# EAGLE design pc_healthypi_move_nRF5340_v1 (EAGLE 9.6.2)
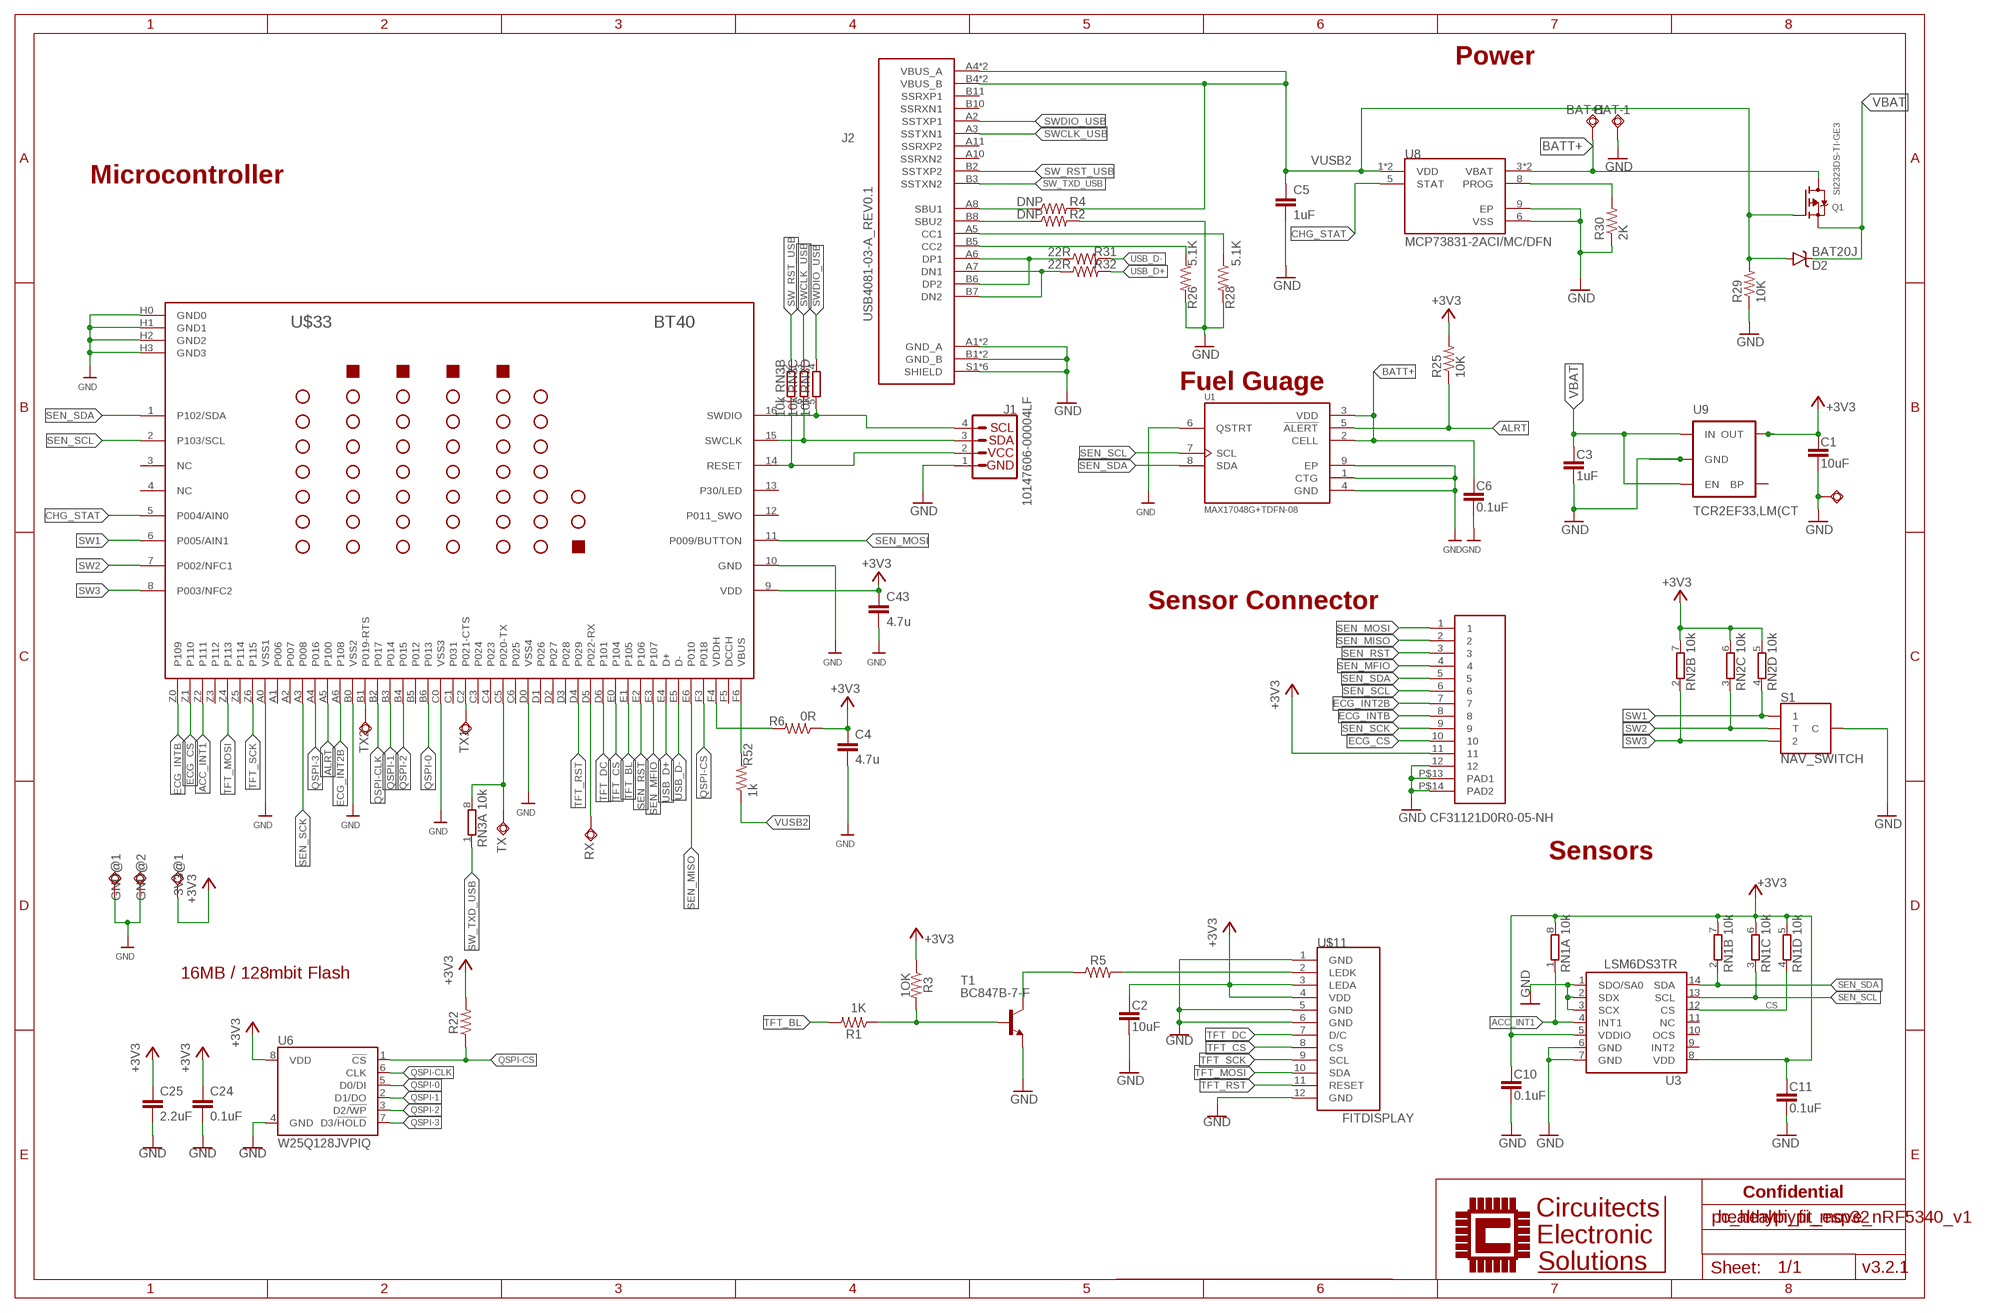
[diagram p0: schematic, sheet 1]

## Parts
3V3@1  TPSQTP13SQ  [TP13SQ]
BAT+1  TPSQTP13SQ  [TP13SQ]
BAT-1  TPSQTP13SQ  [TP13SQ]
C1  10uF  0.1UF-0603-100V-10%  [0603@1]
C2  10uF  0.1UF-0603-100V-10%  [0603@1]
C3  1uF  0.1UF-0402T-6.3V-10%-X7R  [0402-TIGHT]
C4  4.7u  C-EUC0402  [C0402]
C5  1uF  2.2UF-0402_TIGHT-10V-10%-X5R  [0402-TIGHT]
C6  0.1uF  0.1UF-0402T-6.3V-10%-X7R  [0402-TIGHT]
C10  0.1uF  0.1UF-0402T-6.3V-10%-X7R  [0402-TIGHT]
C11  0.1uF  0.1UF-0402T-6.3V-10%-X7R  [0402-TIGHT]
C24  0.1uF  0.1UF-0402T-6.3V-10%-X7R  [0402-TIGHT]
C25  2.2uF  2.2UF-0402_TIGHT-10V-10%-X5R  [0402-TIGHT]
C43  4.7u  C-EUC0402  [C0402]
D2  BAT20J  DIODE-SCHOTTKY-BAT20J  [SOD-323]
GND@1  TPSQTP13SQ  [TP13SQ]
GND@2  TPSQTP13SQ  [TP13SQ]
J1  10147606-00004LF  QWIIC_CONNECTORJS-1MM  [JST04_1MM_RA]
J2  USB4081-03-A_REV0.1  [GCT_USB4081-03-A_REV0.1]
Q1  SI2323DS-TI-GE3  MOSFET-P  [SOT23-R]
R1  200  R-US_R0402  [R0402]
R2  DNP  RESISTOR0402-RES  [0402-RES]
R3  200  R-US_R0402  [R0402]
R4  DNP  RESISTOR0402-RES  [0402-RES]
R5  200R  R-US_R0402  [R0402]
R6  0R  RESISTOR0402-RES  [0402-RES]
R22  10k  R-US_R0402  [R0402]
R25  10K  RESISTOR0402-RES  [0402-RES]
R26  5.1K  RESISTOR0402-RES  [0402-RES]
R28  5.1K  RESISTOR0402-RES  [0402-RES]
R29  10K  R-US_R0402  [R0402]
R30  2K  R-US_R0402  [R0402]
R31  22R  RESISTOR0402-RES  [0402-RES]
R32  22R  RESISTOR0402-RES  [0402-RES]
R52  1k  RESISTOR0402-RES  [0402-RES]
RN1  10k  4R-N0402ARV341  [4X0402ARV341]
RN2  10k  4R-N0402ARV341  [4X0402ARV341]
RN3  10k  4R-N0402ARV341  [4X0402ARV341]
RX  TPSQTP13SQ  [TP13SQ]
S1  NAV_SWITCH  [NAV_SWITCH]
SWIO6  TPSQTP11R  [TP11R]
T1  BC847B-7-F  MMBT2222ALT1-NPN-SOT23-BEC  [SOT23-BEC]
TX  TPSQTP13SQ  [TP13SQ]
TX1  TPSQTP13SQ  [TP13SQ]
TX2  TPSQTP13SQ  [TP13SQ]
U1  MAX17048G+TDFN-08  [SON50P200X200X80-9N]
U3  LSM6DS3TR  LSM6DS3  [LGA14L]
U6  W25Q128JVPIQ  W25QXX128MBIT-6X5-SKINNY_CENTER  [WSON-8-6X5-SKINNY_CENTERPAD]
U8  MCP73831-2ACI/MC/DFN  [SON50P200X300X100-9N]
U9  TCR2EF33,LM(CT  V_REG_LDOSMD  [SOT23-5]
U$5  CF31121D0R0-05-NH  [CF31121D0R0-05-NH]
U$11  FITDISPLAY  [FITDISPLAY]
U$33  BT40  [BT40]

## Nets
+3V3: 3V3@1.TP C1.1 C2.1 C4.1 C10.1 C11.1 C24.1 C25.1 C43.1 R3.1 R6.1 R22.2 R25.2 RN1.5 RN1.6 RN1.7 RN1.8 RN2.5 RN2.6 RN2.7 U3.5(VDDIO) U3.8(VDD) U6.8(VDD) U9.5(OUT) U$5.11 U$11.3(LEDA) U$11.4(VDD) U$33.9(VDD)
ACC_INT1: RN1.1 U3.4(INT1) U$33.Z2(P111)
ALRT: R25.1 U1.5(!ALERT) U$33.A5(P100)
BATT+: BAT+1.TP C6.1 Q1.3(D) U1.2(CELL) U1.3(VDD) U8.3(VBAT) U8.4(VBAT)
CHG_STAT: U8.5(STAT) U$33.5(P004/AIN0)
CS: RN1.4 U3.12(CS)
ECG_CS: U$5.10 U$33.Z1(P110)
ECG_INT2B: U$5.7 U$33.A6(P108)
ECG_INTB: U$5.8 U$33.Z0(P109)
GND: BAT-1.TP C1.2 C2.2 C3.2 C4.2 C5.2 C6.2 C10.2 C11.2 C24.2 C25.2 C43.2 GND@1.TP GND@2.TP J1.1 J2.A1(GND_A) J2.A12(GND_A) J2.B1(GND_B) J2.B12(GND_B) J2.S1(SHIELD) J2.S2(SHIELD) J2.S3(SHIELD) J2.S4(SHIELD) J2.S5(SHIELD) J2.S6(SHIELD) R2.2 R26.2 R28.2 R29.1 R30.1 S1.C SWIO6.TP T1.E U1.1(CTG) U1.4(GND) U1.6(QSTRT) U1.9(EP) U3.1(SDO/SA0) U3.2(SDX) U3.3(SCX) U3.6(GND) U3.7(GND) U6.4(GND) U8.6(VSS) U8.9(EP) U9.2(GND) U$5.12 U$5.P$13(PAD1) U$5.P$14(PAD2) U$11.1(GND) U$11.5(GND) U$11.6(GND) U$11.12(GND) U$33.10(GND) U$33.A0(VSS1) U$33.B0(VSS2) U$33.C0(VSS3) U$33.D0(VSS4) U$33.H0(GND0) U$33.H1(GND1) U$33.H2(GND2) U$33.H3(GND3)
N$1: J2.B8(SBU2) R2.1
N$2: J2.A8(SBU1) R4.1
N$3: TX2.TP U$33.B1(P019-RTS)
N$4: J2.B5(CC2) R26.1
N$5: TX1.TP U$33.C2(P021-CTS)
N$6: J2.A5(CC1) R28.1
N$7: R30.2 U8.8(PROG)
N$8: J2.A6(DP1) J2.B6(DP2) R31.1
N$9: J2.A7(DN1) J2.B7(DN2) R32.1
N$18: R5.2 U$11.2(LEDK)
N$21: R5.1 T1.C
N$23: R1.1 R3.2 T1.B
N$25: R52.2 U$33.F6(VBUS)
N$26: R6.2 U$33.F4(VDDH)
QSPI-0: U6.5(D0/DI) U$33.B6(P013)
QSPI-1: U6.2(D1/DO) U$33.B3(P014)
QSPI-2: U6.3(D2/!WP!) U$33.B4(P015)
QSPI-3: U6.7(D3/!HOLD!) U$33.A4(P016)
QSPI-CLK [Clock]: U6.6(CLK) U$33.B2(P017)
QSPI-CS: R22.1 U6.1(!CS!) U$33.F3(P018)
RESET1: J1.2 RN3.7 U$33.14(RESET)
SEN_MFIO: U$5.4 U$33.E3(P107)
SEN_MISO: U$5.2 U$33.E6(P010)
SEN_MOSI: U$5.1 U$33.11(P009/BUTTON)
SEN_RST: U$5.3 U$33.E2(P106)
SEN_SCK: U$5.9 U$33.A3(P008)
SEN_SCL: RN1.3 U1.7(SCL) U3.13(SCL) U$5.6 U$33.2(P103/SCL)
SEN_SDA: RN1.2 U1.8(SDA) U3.14(SDA) U$5.5 U$33.1(P102/SDA)
SW1: RN2.4 S1.1 U$33.6(P005/AIN1)
SW2: RN2.3 S1.T U$33.7(P002/NFC1)
SW3: RN2.2 S1.2 U$33.8(P003/NFC2)
SW_RST_USB: J2.B2(SSTXP2) RN3.2
SW_TXD_USB: J2.B3(SSTXN2) RN3.1
SWCLK1: J1.3 RN3.6 U$33.15(SWCLK)
SWCLK_USB: J2.A3(SSTXN1) RN3.3
SWDIO1: J1.4 RN3.5 U$33.16(SWDIO)
SWDIO_USB: J2.A2(SSTXP1) RN3.4
TFT_BL: R1.2 U$33.E1(P105)
TFT_CS: U$11.8(CS) U$33.E0(P104)
TFT_DC: U$11.7(D/C) U$33.D6(P101)
TFT_MOSI: U$11.10(SDA) U$33.Z4(P113)
TFT_RST: U$11.11(RESET) U$33.D4(P029)
TFT_SCK: U$11.9(SCL) U$33.Z6(P115)
UART_RX: RX.TP U$33.D5(P022-RX)
UART_TX: RN3.8 TX.TP U$33.C5(P020-TX)
USB_D+: R32.2 U$33.E4(D+)
USB_D-: R31.2 U$33.E5(D-)
VBAT: C3.1 D2.C Q1.2(S) U9.1(IN) U9.3(EN)
VUSB2: C5.1 D2.A J2.A4(VBUS_A) J2.A9(VBUS_A) J2.B4(VBUS_B) J2.B9(VBUS_B) Q1.1(G) R4.2 R29.2 R52.1 U8.1(VDD) U8.2(VDD)
Unconnected: J2.A10(SSRXN2) J2.A11(SSRXP2) J2.B10(SSRXN1) J2.B11(SSRXP1) RN2.1 RN2.8 U3.9(INT2) U3.10(OCS) U3.11(NC) U9.4(BP) U$33.3(NC) U$33.4(NC) U$33.12(P011_SWO) U$33.13(P30/LED) U$33.A1(P006) U$33.A2(P007) U$33.B5(P012) U$33.C1(P031) U$33.C3(P024) U$33.C4(P023) U$33.C6(P025) U$33.D1(P026) U$33.D2(P027) U$33.D3(P028) U$33.F5(DCCH) U$33.Z3(P112) U$33.Z5(P114)

## Notes on the sheet
- Power
- Microcontroller
- Fuel Guage
- Sensor Connector
- CF31121D0R0-05-NH
- Sensors
- 16MB / 128mbit Flash
- 1OK
- 1K
- Confidential
- healthypi_fit_esp32
- v3.2.1

## Library data of the parts
3V3@1 BAT+1 BAT-1 GND@1 GND@2 RX SWIO6 TX TX1 TX2 = testpad:TPSQ: Test pad
C1 C2 = SparkFun-Capacitors:0.1UF: 0.1µF ceramic capacitors A capacitor is a passive two-terminal electrical component used to store electrical energy temporarily in an electric field.; PROD_ID: CAP-08390; VALUE: 0.1uF
C3 = SparkFun-Capacitors:0.1UF: 0.1µF ceramic capacitors A capacitor is a passive two-terminal electrical component used to store electrical energy temporarily in an electric field.; PROD_ID: CAP-14993; VALUE: 0.1uF
C4 C43 = rcl:C-EU: CAPACITOR, European symbol; SPICEPREFIX: C
C5 = SparkFun-Capacitors:2.2UF: 2.2µF ceramic capacitors A capacitor is a passive two-terminal electrical component used to store electrical energy temporarily in an electric field.; PROD_ID: CAP-14232; VALUE: 2.2uF
C6 C10 C11 C24 = SparkFun-Capacitors:0.1UF: 0.1µF ceramic capacitors A capacitor is a passive two-terminal electrical component used to store electrical energy temporarily in an electric field.; PROD_ID: CAP-14993
C25 = SparkFun-Capacitors:2.2UF: 2.2µF ceramic capacitors A capacitor is a passive two-terminal electrical component used to store electrical energy temporarily in an electric field.; PROD_ID: CAP-14232
D2 = SparkFun-DiscreteSemi:DIODE-SCHOTTKY: Schottky diodes in SFE's production catalog BAT20J 1A 23V 0.62Vf RB751 120mA 40V 0.37Vf PMEG4005EJ 0.5A 40V 0.42Vf MBRA140 1A 40V 0.5Vf B340A 3A 40V SMA; PROD_ID: DIO-11623
J1 = SparkFun-Connectors:QWIIC_CONNECTOR: SparkFun I2C Standard Qwiic Connector An SMD 1mm pitch JST connector makes it easy and quick (get it? Qwiic?) to connect I2C devices to each other. The Qwiic system <http://www.sparkfun.com/qwiic> enables fast and solderless connection between popular platforms and various sensors and actuators. We carry 200mm <https://www.sparkfun.com/products/14204>, 100mm <https://www.sparkfun.com/products/14205>, 50mm <https://www.sparkfun.com/products/14206>, and breadboard friendly <https://www.sparkfun.com/products/14207> Qwiic cables. We also offer 10 pcs strips <https://www.sparkfun.com/products/14323> the SMD connectors.; PROD_ID: CONN-13694; VALUE: QWIIC_RIGHT_ANGLE
J2 = circuitects:USB4081-03-A_REV0.1: Check availability <https://pricing.snapeda.com/parts/USB4081-03-A/Global%20Connector%20Technology/view-part?ref=eda>; AVAILABILITY: In Stock; DESCRIPTION: Type C USB 3.2 Gen 2 Connector; MF: Global Connector Technology; MP: USB4081-03-A; PACKAGE: None; PRICE: None
Q1 = microbuilder:MOSFET-P: P-Channel Mosfet SOT-23 IRLML5103 30V 760mA 1V Vgs - Digikey: IRLML5103PBFCT-ND NTR0202PL 20V 400mA 2.3V Vgs - Digikey: NTR0202PLT1GOSTR-ND NTR4101PT1G 20V 1.8A 1.2V Vgs - Digikey: NTR4101PT1GOSCT-ND DMP2004K 20V 600mA 1V Vgs - Digikey: DMP2004KDICT-ND
R1 R3 R5 R22 R29 R30 = rcl:R-US_: RESISTOR, American symbol; SPICEPREFIX: R
R2 R4 R6 R25 R26 R28 R31 R32 R52 = SparkFun:RESISTOR: Resistor Basic schematic elements and footprints for 0603, 1206, and PTH resistors.
RN1-RN3 = resistor-dil:4R-N: Array Chip Resistor Source: RS Component / Phycomp; OC_FARNELL: unknown; OC_NEWARK: unknown
S1 = SparkFun-Switches:NAV_SWITCH: Navigation Switch Three way navigation switch. Commonly used as up/down/select on MP3 players. Schematic element and footprint production proven. SparkFun Products Surface Mount Navigation Switch <https://www.sparkfun.com/products/8184> (COM-08184) Used on SparkFun MP3 Trigger <https://www.sparkfun.com/products/13720>; PROD_ID: SWCH-08301; SF_SKU: COM-08184
T1 = transistor:*-NPN-: NPN Transistror BF959 corrected 2008.03.06
U1 = circuitects:MAX17048G+: Micropower 1-Cell/2-Cell Li+ ModelGauge ICs Check availability <https://pricing.snapeda.com/parts/MAX17048G%2B/Analog%20Devices/view-part?ref=eda>; AVAILABILITY: In Stock; DESCRIPTION: 3µA 1-Cell/2-Cell Fuel Gauge with ModelGauge; MF: Analog Devices; MP: MAX17048G+; PACKAGE: TDFN-8 Maxim; PRICE: None; PURCHASE-URL: https://pricing.snapeda.com/search/part/MAX17048G+/?ref=eda
U3 = LSM6DS3:LSM6DS3
U6 = SparkFun-IC-Memory:W25QXX; PROD_ID: IC-15107
U8 = circuitects:MCP73831-2ACI/MC/DFN: MCP73831 Series Single-Cell Li-Ion/Li-Polymer Battery Charge Controller - DFN-8 Check availability <https://pricing.snapeda.com/parts/MCP73831-2ACI/MC/Microchip%20Technology/view-part?ref=eda>; AVAILABILITY: In Stock; DESCRIPTION: Linear Battery Charger Controller Li-Ion/Li-Pol 505mA 4.2V 8-Pin DFN EP Tube; MF: Microchip Technology; MP: MCP73831-2ACI/MC; PACKAGE: None; PRICE: None; PURCHASE-URL: https://pricing.snapeda.com/search/part/MCP73831-2ACI/MC/?ref=eda
U9 = SparkFun-PowerIC:V_REG_LDO: Voltage Regulator LDO Standard 150mA LDO voltage regulator in SOT-23 layout. Micrel part MIC5205. BP (by-pass) pin is used to lower output noise with 470pF cap.; PROD_ID: VREG-12457
U$5 = circuitects:CF31121D0R0-05-NH
U$11 = circuitects:FITDISPLAY
U$33 = circuitects:BT40

## Net classes
2 Clock: width 0.089 mm, clearance 0.178 mm

## Board
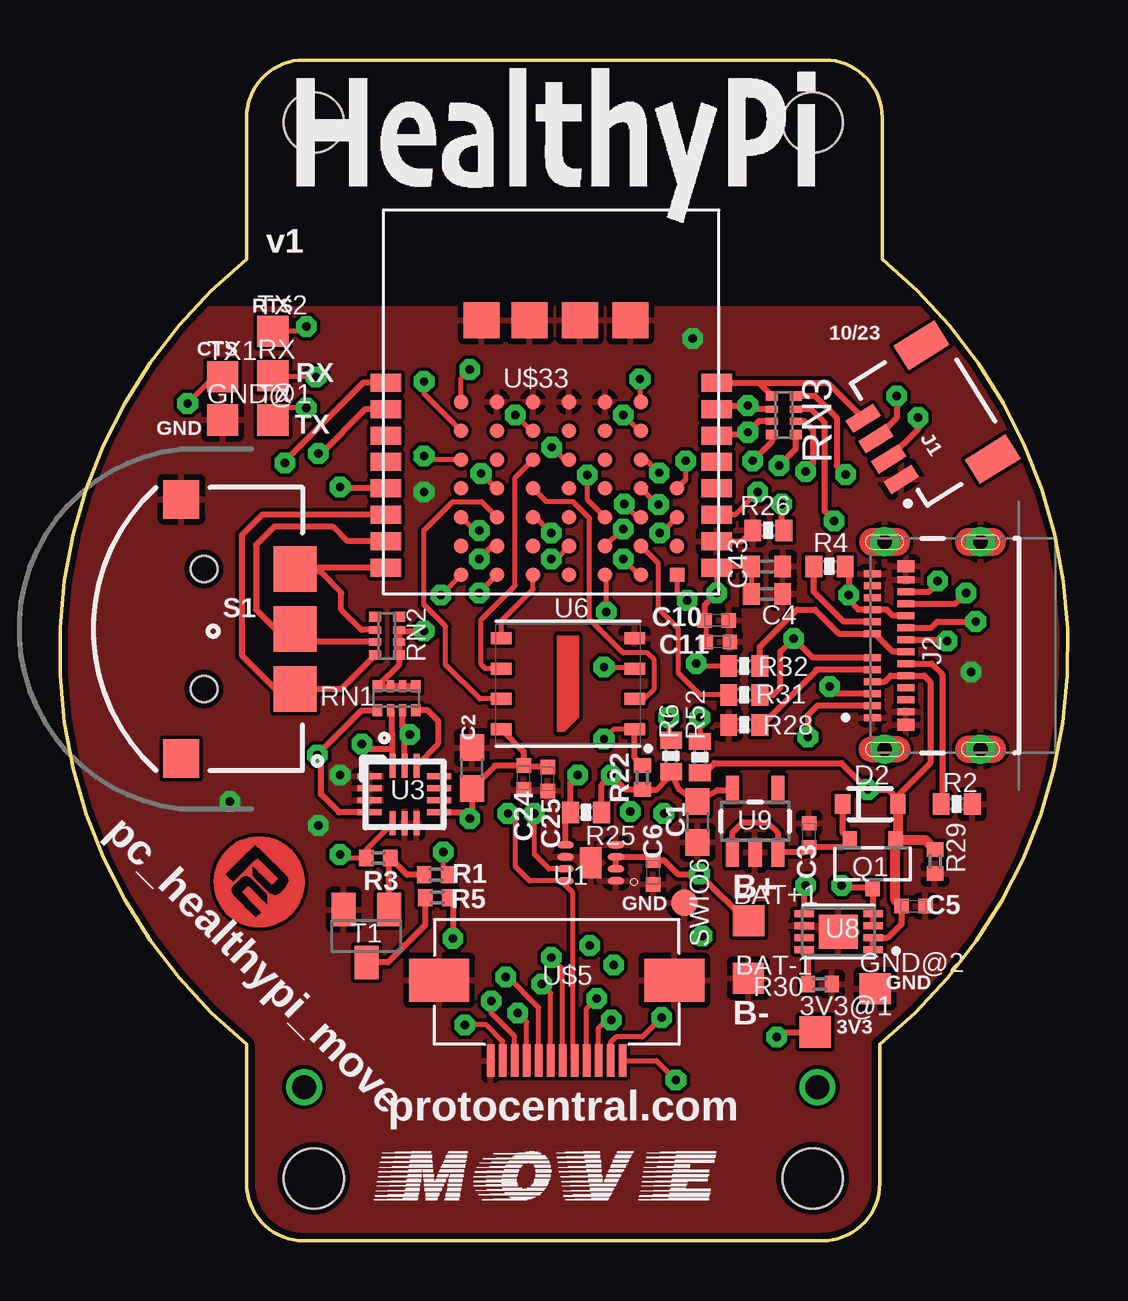
[diagram p1: board, top side]
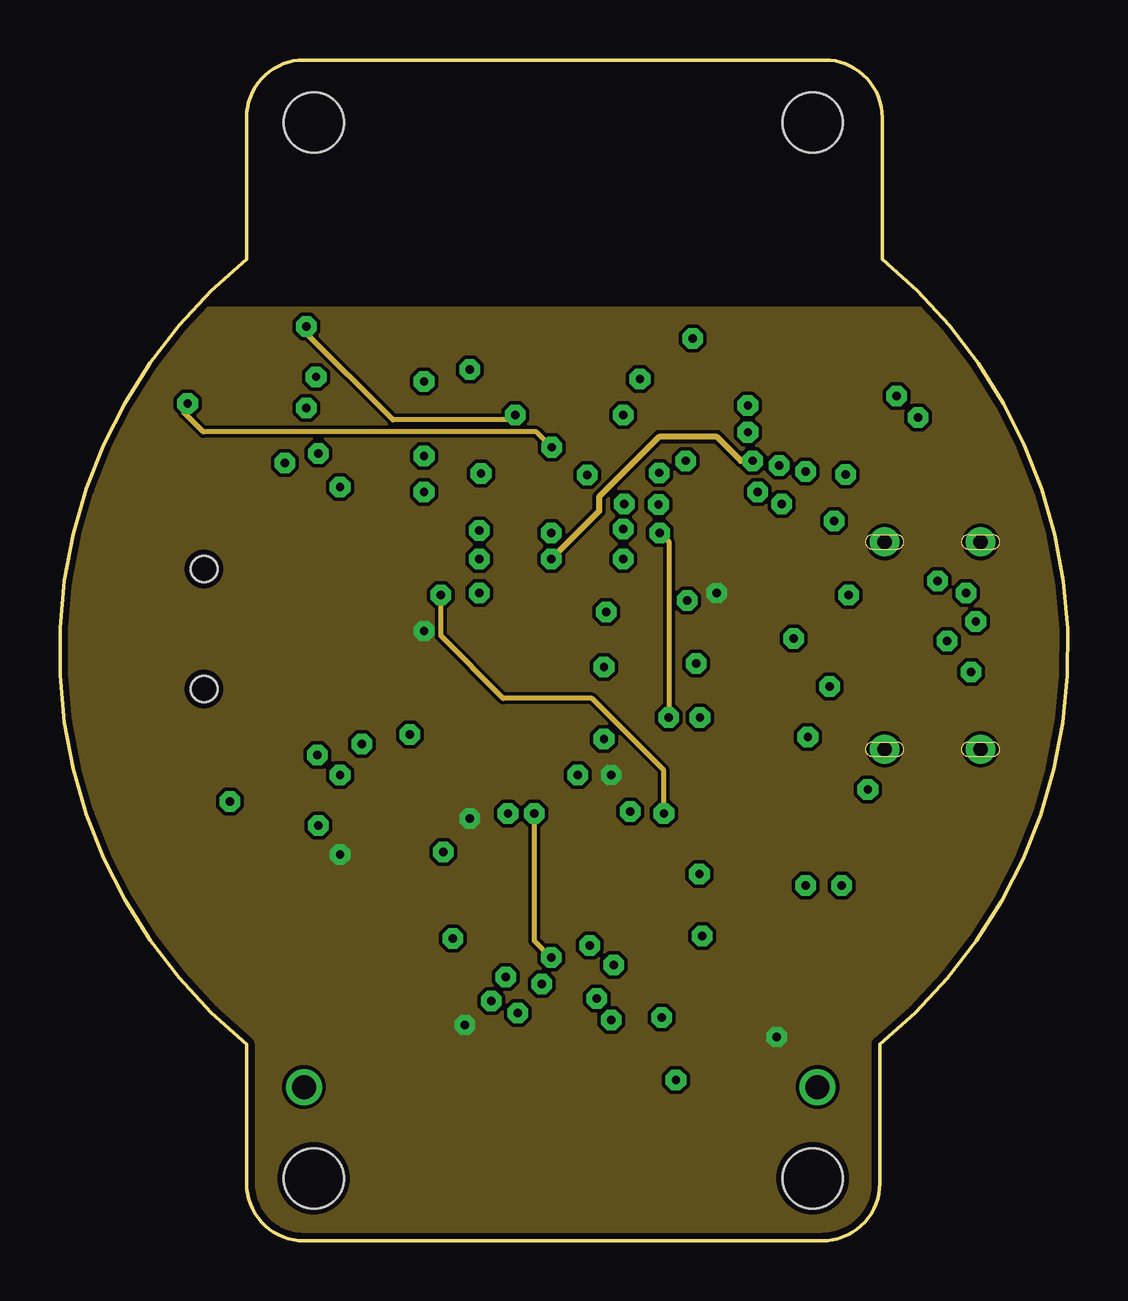
[diagram p2: board, inner layer Route2]
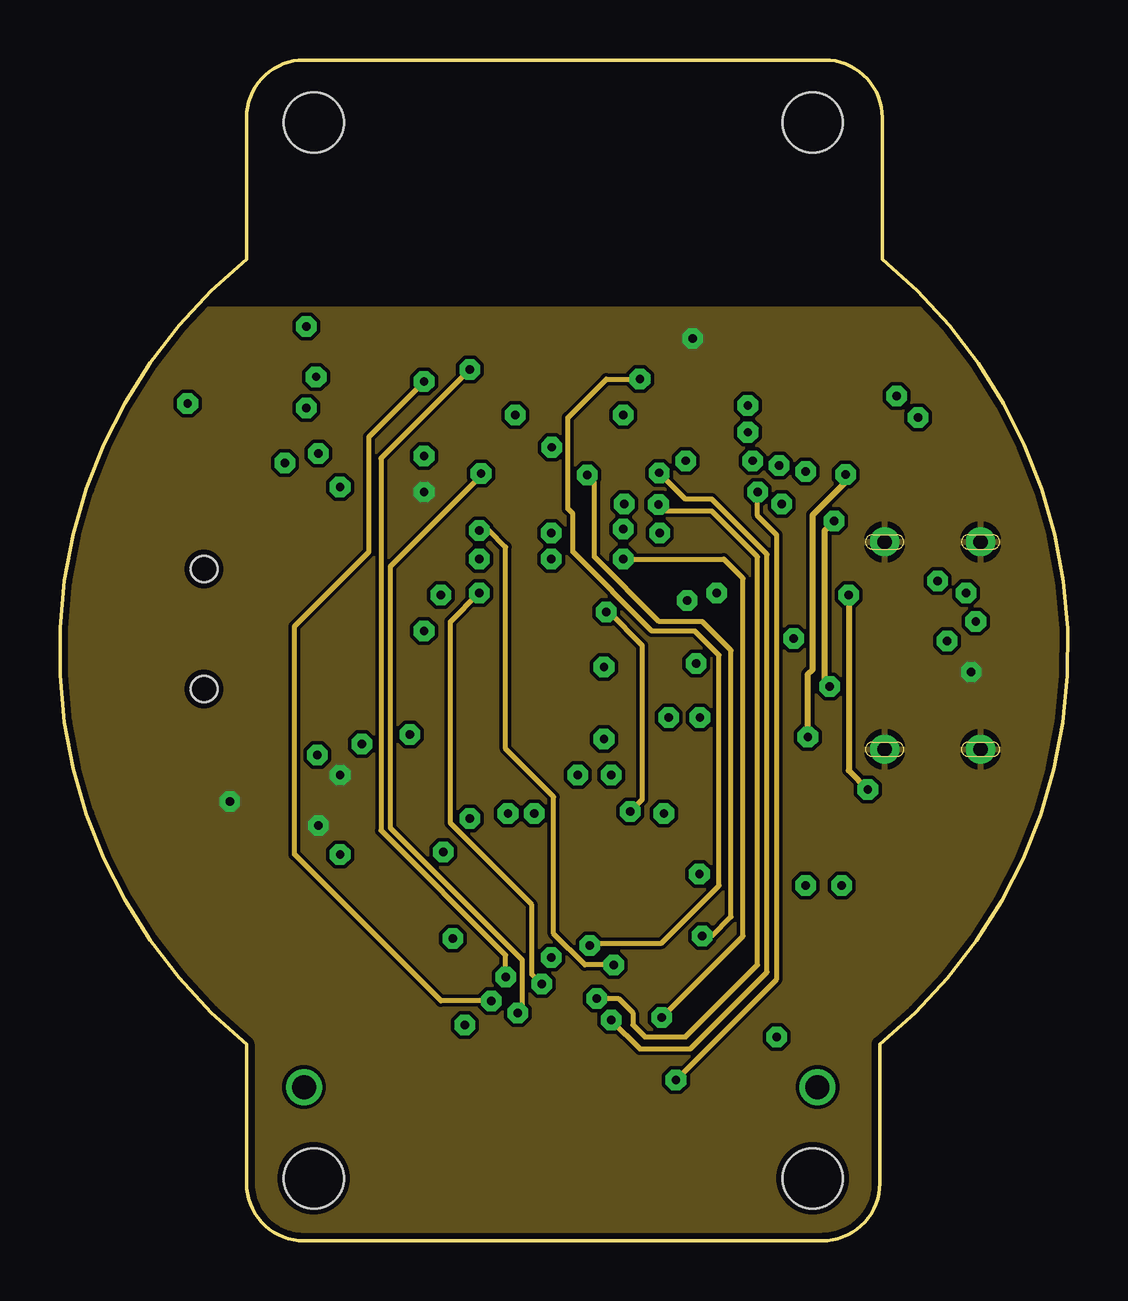
[diagram p3: board, inner layer Route15]
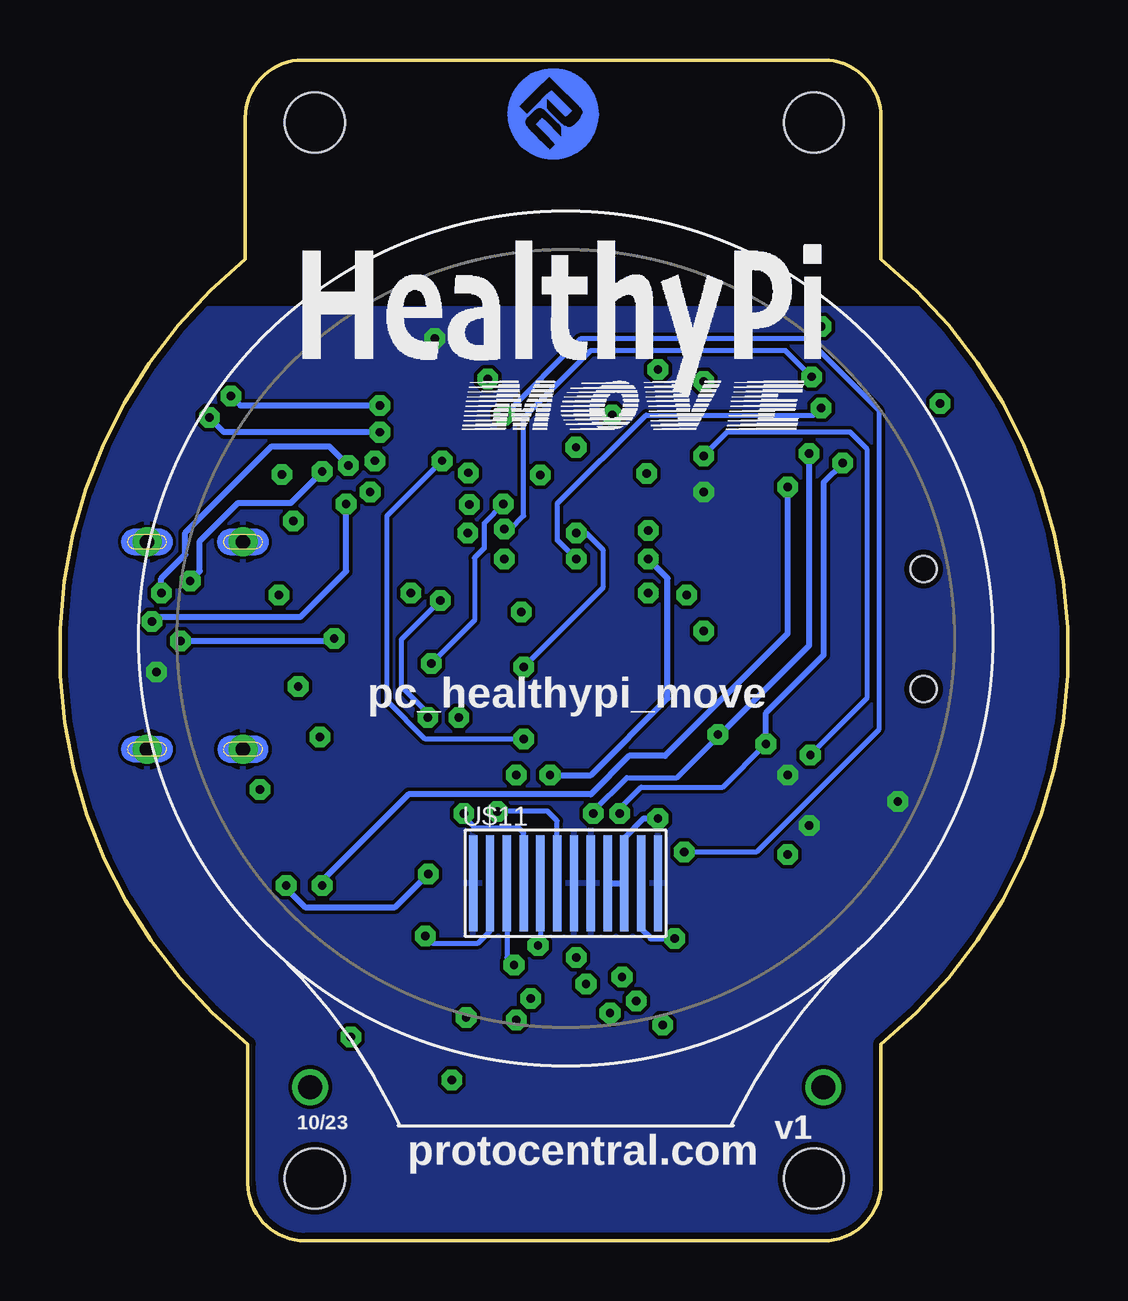
[diagram p4: board, bottom side, seen from below]

Size 42 x 49.2 mm. Coordinates in mm from the lower left corner, seen from the top.
Outline: 10.18,49.2 31.88,49.2 arc-90 34.28,46.8 34.28,40.9 arc-102 34.18,8.2 34.18,2.4 arc-90 31.78,0 10.18,0 arc-90 7.78,2.4 7.78,8.2 arc-102 7.78,40.9 7.78,46.8 arc-90 10.18,49.2
Copper layers (1*2*15*16): Top 0.035mm / dielectric 1.5mm / Route2 0.035mm / dielectric 0.15mm / Route15 0.035mm / dielectric 0.2mm / Bottom 0.035mm
Design rules "Circuitects-Rules *": minimum track width 6mil, minimum drill 0.3mm, track to track 6mil, track to pad 6mil, pad to pad 6mil, via to via 6mil, smd to smd 6mil, copper to edge 10mil, drill to drill 8mil, minimum pad ring 12mil, minimum via ring 10mil, stop-mask expansion 4mil, vias tented up to drill 25mil, thermal gap 10mil
Holes 2.5 mm at 31.38,46.6 10.58,2.6 10.58,46.6 31.38,2.6

### Footprints (pad centres in the part's own frame; a part is rotated, then mirrored left to right if it is on the bottom)
TP13SQ = smd 1.3 x 1.3: TP 0,0
0603@1 = smd 1.1 x 1: 1 -0.85,0; 2 0.85,0
0402-TIGHT = smd 0.6 x 0.6: 1 -0.5,0; 2 0.5,0
C0402 = smd 0.7 x 0.9: 1 -0.65,0; 2 0.65,0
SOD-323 = smd 0.63 x 0.83: A 1.15,0; C -1.15,0
JST04_1MM_RA = smd 0.6 x 1.35: 1 -1.5,0; 2 -0.5,0; 3 0.5,0; 4 1.5,0 | smd 1.2 x 2: NC1 2.8,-3.675; NC2 -2.8,-3.675
GCT_USB4081-03-A_REV0.1 = smd 0.3 x 0.7: A1 -3,0.51; A2 -2.5,0.51; A3 -2,0.51; A4 -1.5,0.51; A5 -1,0.51; A6 -0.5,0.51; A7 0.5,0.51; A8 1,0.51; A9 1.5,0.51; A10 2,0.51; A11 2.5,0.51; A12 3,0.51; B1 2.75,-0.89; B2 2.25,-0.89; B3 1.75,-0.89; B4 1.25,-0.89; B5 0.75,-0.89; B6 0.25,-0.89; B7 -0.25,-0.89; B8 -0.75,-0.89; B9 -1.25,-0.89; B10 -1.75,-0.89; B11 -2.25,-0.89; B12 -2.75,-0.89 | drill 0.6 pad 1.1: S1 -4.32,-4; S2 4.32,-4; S3 -4.32,0; S4 4.32,0 | smd 0.5 x 0.7: S5 -3.3,-0.89; S6 3.3,-0.89
SOT23-R = smd 0.6 x 0.7: 1 -0.95,-1; 2 0.95,-1; 3 0,1
R0402 = smd 0.6 x 0.7: 1 -0.5,0; 2 0.5,0
0402-RES = smd 0.7 x 0.9: 1 -0.65,0; 2 0.65,0
4X0402ARV341 = smd 0.4 x 0.5: 1 -0.8,-0.5; 4 0.8,-0.5; 5 0.8,0.5; 8 -0.8,0.5 | smd 0.3 x 0.5: 2 -0.25,-0.5; 3 0.25,-0.5; 6 0.25,0.5; 7 -0.25,0.5
NAV_SWITCH = smd 1.9 x 1.8: 1 -2.5,-3.8; 2 2.5,-3.8; T 0,-3.8 | smd 1.6 x 1.5: C 5.4,0.95; NC -5.4,0.95 | hole 1.1: -2.5,0; 2.5,0
TP11R = smd 1.1 x 1.1: TP 0,0
SOT23-BEC = smd 1 x 1.4: B -0.95,-1.1; C 0,1.1; E 0.95,-1.1
SON50P200X200X80-9N = smd 0.7 x 0.3: 1 -1.05,0.75; 2 -1.05,0.25; 3 -1.05,-0.25; 4 -1.05,-0.75; 5 1.05,-0.75; 6 1.05,-0.25; 7 1.05,0.25; 8 1.05,0.75 | smd 0.9 x 1.3: 9 0,0
LGA14L = smd 1 x 0.25: 1 -1.45,0.75; 2 -1.45,0.25; 3 -1.45,-0.25; 4 -1.45,-0.75; 8 1.45,-0.75; 9 1.45,-0.25; 10 1.45,0.25; 11 1.45,0.75 | smd 0.25 x 1: 5 -0.5,-1.2; 6 0,-1.2; 7 0.5,-1.2; 12 0.5,1.2; 13 0,1.2; 14 -0.5,1.2
WSON-8-6X5-SKINNY_CENTERPAD = smd 0.85 x 0.5: 1 -2.775,1.905; 2 -2.775,0.635; 3 -2.775,-0.635; 4 -2.775,-1.905; 5 2.775,-1.905; 6 2.775,-0.635; 7 2.775,0.635; 8 2.775,1.905
SON50P200X300X100-9N = smd 0.84 x 0.27: 1 -1.435,0.75; 2 -1.435,0.25; 3 -1.435,-0.25; 4 -1.435,-0.75; 5 1.435,-0.75; 6 1.435,-0.25; 7 1.435,0.25; 8 1.435,0.75 | smd 1.625 x 1.425: 9 0,0
SOT23-5 = smd 0.55 x 1.2: 1 -0.95,-1.3; 2 0,-1.3; 3 0.95,-1.3; 4 0.95,1.3; 5 -0.95,1.3
CF31121D0R0-05-NH = smd 0.3 x 1.35: 1 -2.75,1.675; 2 -2.25,1.675; 3 -1.75,1.675; 4 -1.25,1.675; 5 -0.75,1.675; 6 -0.25,1.675; 7 0.25,1.675; 8 0.75,1.675; 9 1.25,1.675; 10 1.75,1.675; 11 2.25,1.675; 12 2.75,1.675 | smd 2.5 x 1.8: P$13 -4.9,-1.675; P$14 4.9,-1.675
FITDISPLAY = smd 0.35 x 4: 1 3.85,-10.2; 2 3.15,-10.2; 3 2.45,-10.2; 4 1.75,-10.2; 5 1.05,-10.2; 6 0.35,-10.2; 7 -0.35,-10.2; 8 -1.05,-10.2; 9 -1.75,-10.2; 10 -2.45,-10.2; 11 -3.15,-10.2; 12 -3.85,-10.2
BT40 = smd 1.27 x 0.75: 1 -6.9,0.8; 2 -6.9,-0.3; 3 -6.9,-1.4; 4 -6.9,-2.5; 5 -6.9,-3.6; 6 -6.9,-4.7; 7 -6.9,-5.8; 8 -6.9,-6.9; 9 6.9,-6.9; 10 6.9,-5.8; 11 6.9,-4.7; 12 6.9,-3.6; 13 6.9,-2.5; 14 6.9,-1.4; 15 6.9,-0.3; 16 6.9,0.8 | smd 0.6 x 0.6: A0 -2.25,0; A1 -2.25,-1.2; A2 -2.25,-2.4; A3 -2.25,-3.6; A4 -2.25,-4.8; A5 -2.25,-6; A6 -2.25,-7.2; B0 -0.75,0; B1 -0.75,-1.2; B2 -0.75,-2.4; B3 -0.75,-3.6; B4 -0.75,-4.8; B5 -0.75,-6; B6 -0.75,-7.2; C0 0.75,0; C1 0.75,-1.2; C2 0.75,-2.4; C3 0.75,-3.6; C4 0.75,-4.8; C5 0.75,-6; C6 0.75,-7.2; D0 2.25,0; D1 2.25,-1.2; D2 2.25,-2.4; D3 2.25,-3.6; D4 2.25,-4.8; D5 2.25,-6; D6 2.25,-7.2; E0 3.75,0; E1 3.75,-1.2; E2 3.75,-2.4; E3 3.75,-3.6; E4 3.75,-4.8; E5 3.75,-6; E6 3.75,-7.2; F3 5.25,-3.6; F4 5.25,-4.8; F5 5.25,-6; F6 5.25,-7.2; Z0 -3.75,0; Z1 -3.75,-1.2; Z2 -3.75,-2.4; Z3 -3.75,-3.6; Z4 -3.75,-4.8; Z5 -3.75,-6; Z6 -3.75,-7.2 | smd 1.5 x 1.5: H0 -2.9,3.4; H1 -0.9,3.4; H2 1.2,3.4; H3 3.3,3.4

### Placement (x,y rotation side)
3V3@1  31.48,8.7 0 top
BAT+1  28.71,13.33 0 top
BAT-1  28.7,10.94 0 top
C1  26.58,17.45 270 top
C2  17.18,19.7 90 top
C3  31.23,16.9 90 top
C4  29.48,26.95 0 top
C5  35.58,13.95 0 top
C6  24.73,15.35 270 top
C10  27.38,25.85 0 top
C11  27.43,24.95 0 top
C24  19.33,19.3 270 top
C25  20.33,19.25 270 top
C43  29.48,28.1 0 top
D2  33.78,18.2 0 top
GND@1  6.78,34.2 0 top
GND@2  33.98,10.5 0 top
J1  34.28,33 122 top
J2  34.38,24.8 90 top
Q1  33.88,15.71 180 top
R1  15.68,15.25 0 top
R2  37.38,18.2 0 top
R3  13.28,15.95 0 top
R4  32.08,28.1 0 top
R5  15.73,14.3 0 top
R6  25.48,20.2 90 top
R22  24.28,19.3 270 top
R25  21.93,17.85 0 top
R26  29.53,29.6 180 top
R28  28.53,21.5 180 top
R29  36.48,15.8 90 top
R30  31.68,10.7 180 top
R31  28.53,22.75 180 top
R32  28.53,23.95 180 top
R52  26.68,20.15 90 top
RN1  14.03,22.6 0 top
RN2  13.63,25.2 270 top
RN3  30.18,34.4 90 top
RX  8.88,36.05 0 top
S1  6.01,25.49 90 top
SWIO6  26.03,14.08 0 top
T1  12.78,12.7 180 top
TX  8.88,34.2 0 top
TX1  6.78,36 0 top
TX2  8.88,37.9 0 top
U1  22.13,15.75 180 top
U3  14.36,18.6 0 top
U6  21.18,23.21 180 top
U8  32.46,12.88 180 top
U9  28.98,17.48 0 top
U$1  [HEALTHYPI_MOVE_LOGO]  9.88,39.1 0 top
U$5  20.71,9.18 180 top
U$6  [HEALTHYPI_MOVE_LOGO_1]  26.08,31.2 0 bottom
U$10  [HEALTHYPI_MOVE_LOGO_1]  12.28,-0.9 0 top
U$11  20.93,25.1 0 bottom
U$13  [HEALTHYPI_MOVE_LOGO]  31.88,31.9 0 bottom
U$14  [PCROUNDLOGO_GOLD]  5.48,12.7 0 top
U$15  [PCROUNDLOGO_GOLD]  24.28,44.7 0 bottom
U$33  20.48,34.95 0 top

### Tracks (layer width: path | path; a pad name or v marks a point on that pad's centre or on a via)
+3V3  (via drill 0.35)
  Top 0.2: U$33.9 27.33,28.1 C43.1 C4.1 | C10.1 26.93,25.8 C11.1 | U3.5 12.78,16.32 R3.1 11.83,15.95 v11.68,16.1 | v16.88,9 17.78,9 18.46,8.32 U$5.11
  Top 0.254: U9.5 27.41,18.78 C1.1 25.81,18.8 R6.1 25.33,19.4 25.33,19.25 24.88,18.8 R22.2 23.58,18.8 v22.98,19.4 22.58,19 R25.2 | U6.8 19.33,20.38 C24.1 | C25.1 19.38,19.75 C24.1 | RN1.5 RN1.6 RN1.7 RN1.8 14.13,24 RN2.5 RN2.6 RN2.7 14.18,25.4 v15.18,25.4 | U3.8 16.83,17.85 v17.08,17.6 17.18,17.7 C2.1 18.13,19.8 C24.1 | U$33.9 v27.38,27 26.88,26.5 C10.1 | v29.88,8.5 30.08,8.7 3V3@1.TP
  Bottom 0.254: U$11.4 U$11.3 18.48,16.8 17.68,17.6 v17.08,17.6
  pour Route2: -0.17,38.85 42.23,38.85 42.23,-0.1 -0.17,-0.1
ACC_INT1  (via drill 0.35)
  Top 0.2: U$33.Z2 15.33,32.55 v15.18,32.7
  Top 0.254: U3.4 11.63,17.85 10.88,18.6 10.88,20.1 v10.72,20.25 12.58,22.1 RN1.1
  Bottom 0.2: v15.18,32.7 14.18,33.7 9.08,33.7 8.38,33 8.38,22.6 10.42,20.55 v10.72,20.25
ALRT  (via drill 0.35)
  Top 0.254: U1.5 21.08,17.65 R25.1 21.28,19.1 v21.58,19.4 | U$33.A5 18.03,28.95 v17.48,28.4
  Bottom 0.254: v21.58,19.4 19.88,19.4 16.68,22.6 16.68,27.6 v17.48,28.4
BATT+  (via drill 0.35)
  Top 0.254: U8.3 U8.4 33.88,13.64 Q1.3 32.67,14.71 v32.58,14.8 | U1.2 U1.3 24.58,16 C6.1 25.19,15.85 25.76,15.28 v26.66,15.28 28.61,13.33 BAT+1.TP
  Bottom 0.254: v32.58,14.8 32.58,14.7 31.78,13.9 28.04,13.9 v26.66,15.28
CHG_STAT  (via drill 0.35)
  Top 0.254: U$33.5 11.73,31.35 v11.68,31.4 | v31.08,14.8 31.02,14.75 U8.5
  Bottom 0.254: v31.08,14.8 31.08,15 27.48,18.6 19.88,18.6 18.28,20.2 16.78,20.2 11.68,25.3 v11.68,31.4
CS
  Top 0.254: U3.12 15.76,20.7 15.76,21.67 15.33,22.1 RN1.4
ECG_CS  (via drill 0.35)
  Top 0.2: U$5.10 18.96,8.52 17.98,9.5 v17.98,10 | v15.18,35.8 15.18,35.3 U$33.Z1
  Route15 0.2: v17.98,10 15.88,10 9.78,16.1 9.78,25.6 12.88,28.7 12.88,33.5 v15.18,35.8
ECG_INT2B  (via drill 0.35)
  Top 0.2: U$5.7 20.46,10.32 v20.08,10.7 | v17.48,27 U$33.A6
  Route15 0.2: v20.08,10.7 19.68,11.1 19.68,14 16.28,17.4 16.28,25.8 v17.48,27
ECG_INTB  (via drill 0.35)
  Top 0.2: U$5.8 19.96,9.72 18.68,11 v18.58,11 | v17.08,36.3 16.73,35.95 U$33.Z0
  Route15 0.2: v18.58,11 18.58,11.9 13.38,17.1 13.38,32.6 v17.08,36.3
GND  (via drill 0.35)
  Top 0.254: U$33.10 28.43,29.15 R26.2
  other vias: 11.68,19.4 7.08,18.3 15.18,31.2 26.38,37.6 37.98,23.7 10.78,17.3
  pour Top: -0.17,-0.1 42.23,-0.1 42.23,38.88 -0.17,38.88
  pour Bottom: -0.17,-0.1 42.23,-0.1 42.23,38.88 -0.17,38.88
  pour Route15: -0.17,38.85 42.23,38.85 42.23,-0.1 -0.17,-0.1
N$1
  Top 0.254: J2.B8 36.33,24.05 36.78,23.6 36.78,18.25 R2.1
N$2
  Top 0.254: R4.1 31.43,27.05 32.68,25.8 J2.A8
N$3  (via drill 0.35)
  Top 0.2: U$33.B1 19.63,33.75 v18.98,34.4 | v10.28,38.1 10.08,37.9 TX2.TP
  Route2 0.2: v18.98,34.4 18.78,34.2 13.88,34.2 10.18,37.9 10.18,38 v10.28,38.1
N$4  (via drill 0.35)
  Top 0.254: v30.08,30.7 30.08,29.7 R26.1 | J2.B5 36.33,25.55 36.58,25.8 v38.18,25.8
  Bottom 0.254: v38.18,25.8 37.98,26 31.98,26 30.08,27.9 v30.08,30.7
N$5  (via drill 0.35)
  Top 0.2: U$33.C2 21.03,32.55 20.51,33.06 v20.49,33.06 | v5.32,34.89 6.43,36 TX1.TP
  Route2 0.2: v20.49,33.06 19.86,33.7 5.98,33.7 5.18,34.5 5.18,34.75 v5.32,34.89
N$6
  Top 0.254: R28.1 29.28,21.5 31.53,23.75 31.53,23.8 J2.A5
N$7
  Top 0.254: U8.8 31.18,11.98 R30.2
N$8  (via drill 0.35)
  Top 0.254: R31.1 29.73,22.75 30.03,23.05 30.03,24.55 v30.58,25.1 31.38,24.3 J2.A6 | J2.B6 36.93,25.05 v36.98,25
  Bottom 0.254: v36.98,25 30.68,25 v30.58,25.1
N$9
  Top 0.254: R32.1 29.18,24.75 30.73,26.3 31.48,26.3 32.48,25.3 J2.A7 33.98,25.3 34.73,24.55 J2.B7
N$18  (via drill 0.35)
  Top 0.254: R5.2 16.38,14.15 v16.38,12.6
  Bottom 0.254: U$11.2 17.78,13 17.38,12.6 v16.38,12.6
N$21
  Top 0.254: R5.1 15.23,13.15 13.68,11.6 T1.C
N$23
  Top 0.254: T1.B 13.73,15.9 R3.2 14.48,15.25 R1.1
N$25  (via drill 0.35)
  Top 0.2: U$33.F6 25.73,27.05 26.13,26.65 v26.15,26.67 | v26.68,21.8 R52.2
  Bottom 0.2: v26.15,26.67 27.78,25.05 27.78,23.1 26.68,22 v26.68,21.8
N$26  (via drill 0.35)
  Top 0.2: U$33.F4 25.18,29.6 25.08,29.6 25.01,29.53 v25.01,29.5 | v25.38,21.8 25.38,20.95 R6.2
  Route2 0.2: v25.01,29.5 25.38,29.13 v25.38,21.8
N$28  (via drill 1)
  other vias: 10.18,6.4
N$29  (via drill 1)
  other vias: 31.58,6.4
QSPI-0
  Top 0.2: U6.5 18.4,25.83 19.73,27.15 U$33.B6
QSPI-1
  Top 0.2: U6.2 24.35,22.58 24.78,23 24.78,24.2 24.48,24.5 23.48,24.5 22.08,25.9 22.08,30.1 21.38,30.8 20.28,30.8 U$33.B3
QSPI-2  (via drill 0.35)
  Top 0.2: U$33.B4 19.83,30.15 v20.48,29.5 | v22.68,23.9 23.9,23.9 U6.3
  Bottom 0.2: v20.48,29.5 20.08,29.5 19.38,28.8 19.38,27.2 v22.68,23.9
QSPI-3
  Top 0.2: U6.7 17.5,22.58 16.08,24 16.08,25.6 15.18,26.5 15.18,29.6 16.37,30.8 17.58,30.8 U$33.A4
QSPI-CLK
  Top 0.2: U6.6 17.73,23.84 17.55,24.02 17.55,25.88 18.98,27.3 18.98,31.8 U$33.B2
QSPI-CS  (via drill 0.35)
  Top 0.2: U6.1 23.08,21.3 v22.68,20.9 | v26.08,32.5 26.08,31.7 U$33.F3
  Top 0.254: R22.1 23.95,20.12 U6.1
  Bottom 0.2: v22.68,20.9 26.78,20.9 28.38,22.5 28.38,30.2 v26.08,32.5
RESET1  (via drill 0.35)
  Top 0.254: U$33.14 27.43,33.6 28.59,33.6 v28.68,33.69 29.14,34.15 RN3.7 | v35.78,34.3 35.78,33.81 J1.2
  Bottom 0.254: v28.68,33.69 35.17,33.69 v35.78,34.3
SEN_MFIO  (via drill 0.35)
  Top 0.2: U$5.4 21.96,9.68 v22.38,10.1 | v24.95,30.67 24.9,30.67 U$33.E3
  Route15 0.2: v22.38,10.1 23.28,10.1 23.88,9.5 23.88,9 24.38,8.5 26.08,8.5 29.08,11.5 29.08,28.5 27.18,30.4 25.28,30.4 24.98,30.7 v24.95,30.67
SEN_MISO  (via drill 0.35)
  Top 0.2: U$5.2 22.96,8.28 23.18,8.5 24.28,8.5 v25.08,9.3 | v23.48,28.4 24.13,27.75 U$33.E6
  Route15 0.2: v23.48,28.4 27.68,28.4 28.48,27.6 28.48,12.7 v25.08,9.3
SEN_MOSI  (via drill 0.35)
  Top 0.2: U$5.1 24.87,7.51 v25.68,6.7 | v29.08,31.2 28.13,30.25 U$33.11
  Route15 0.2: v25.68,6.7 29.88,10.9 29.88,29.4 29.08,30.2 v29.08,31.2
SEN_RST  (via drill 0.35)
  Top 0.2: U$5.3 22.46,8.88 22.78,9.2 v22.98,9.2 | U$33.E2 24.43,32.55 v24.98,32
  Route15 0.2: v22.98,9.2 24.18,8 26.28,8 29.48,11.2 29.48,28.6 27.18,30.9 26.08,30.9 v24.98,32
SEN_SCK  (via drill 0.35)
  Top 0.2: U$5.9 19.46,9.12 v19.08,9.5 | v17.55,31.98 18.18,31.35 U$33.A3
  Route15 0.2: v19.08,9.5 19.28,9.7 19.28,11.7 13.78,17.2 13.78,28.1 17.58,31.9 17.58,31.95 v17.55,31.98
SEN_SCL  (via drill 0.35)
  Top 0.2: U1.7 20.38,15.5 19.78,16.1 v19.78,17.8 | U$5.6 20.96,11.32 v20.48,11.8
  Top 0.254: U$33.2 12.73,34.65 10.88,32.8 v10.78,32.8 | RN1.3 14.28,21.4 v14.58,21.1 14.36,20.88 U3.13
  Route2 0.2: v20.48,11.8 19.78,12.5 v19.78,17.8
  Bottom 0.2: v19.78,17.8 19.78,17.9 18.38,19.3 16.28,19.3 14.48,21.1
  Bottom 0.254: v10.78,32.8 10.78,24.8 14.48,21.1 v14.58,21.1
SEN_SDA  (via drill 0.35)
  Top 0.2: U1.8 20.88,15 | 20.88,15 19.58,15 18.98,15.6 18.98,17.5 v18.68,17.8 | U$5.5 21.38,7.58 21.38,14.5 20.88,15
  Top 0.254: U3.14 13.86,20.5 | 13.86,20.5 13.86,21.12 13.85,21.13 13.85,22.03 RN1.2 | U$33.1 12.63,35.75 9.38,32.5 v9.38,32.4 | v12.58,20.7 12.78,20.5 13.86,20.5
  Bottom 0.2: v18.68,17.8 18.68,18 17.78,18.9 14.38,18.9 v12.58,20.7
  Bottom 0.254: v9.38,32.4 10.18,31.6 10.18,24.4 12.58,22 v12.58,20.7
SW1
  Top 0.254: RN2.4 11.72,22.99 S1.1 8.99,22.99 7.58,24.4 7.58,29.4 8.43,30.25 U$33.6
SW2
  Top 0.254: RN2.3 10.35,24.95 S1.T 8.99,25.49 8.18,26.3 8.18,29 8.93,29.75 11.38,29.75 11.98,29.15 U$33.7
SW3
  Top 0.254: RN2.2 12.58,25.45 11.73,26.3 11.73,27 10.84,27.89 10.63,27.89 | U$33.8 10.79,28.05 10.63,27.89 | S1.2 9.91,27.89 10.63,27.89
SW_RST_USB  (via drill 0.35)
  Top 0.254: J2.B2 36.23,27.05 36.58,27.4 v36.58,27.5 | RN3.2 31.03,34.15 31.38,33.8 31.38,32.35 v31.08,32.05
  Bottom 0.254: v36.58,27.5 36.18,27.9 36.18,29.15 34.58,30.75 32.38,30.75 v31.08,32.05
SW_TXD_USB  (via drill 0.35)
  Top 0.254: J2.B3 37.33,26.55 v37.78,27 | v29.98,32.3 30.68,33 RN3.1
  Bottom 0.254: v37.78,27 37.78,27.6 36.78,28.6 36.78,29.5 33.18,33.1 30.78,33.1 v29.98,32.3
SWCLK1  (via drill 0.35)
  Top 0.254: U$33.15 27.53,34.8 v28.68,34.8 28.83,34.65 RN3.6 | v34.88,35.2 34.88,34.29 J1.3
  Bottom 0.254: v28.68,34.8 34.48,34.8 v34.88,35.2
SWCLK_USB  (via drill 0.35)
  Top 0.254: J2.A3 32.38,22.8 v32.08,23.09 | v32.28,30 31.88,30.4 31.88,34.1 31.33,34.65 RN3.3
  Route15 0.254: v32.08,23.09 31.88,23.29 31.88,29.6 v32.28,30
SWDIO1
  Top 0.254: U$33.16 29.13,35.75 | 29.13,35.75 RN3.5 | 29.13,35.75 32,35.75 J1.4
SWDIO_USB  (via drill 0.35)
  Top 0.254: J2.A2 31.58,22.3 31.18,21.9 v31.18,21 | RN3.4 31.48,35.2 32.38,34.3 32.38,32.3 v32.75,31.92
  Route15 0.254: v31.18,21 31.18,23.6 31.38,23.8 31.38,30.25 32.75,31.62 v32.75,31.92
TFT_BL  (via drill 0.35)
  Top 0.2: U$33.E1 24.13,33.75 v23.48,34.4 | v15.98,16.2 15.98,15.45 R1.2
  Bottom 0.2: v23.48,34.4 20.28,37.6 10.88,37.6 7.88,34.6 7.88,21.3 12.98,16.2 v15.98,16.2
TFT_CS  (via drill 0.35)
  Top 0.2: v24.18,35.9 24.18,35 U$33.E0
  Route15 0.2: v22.08,12.3 22.18,12.4 25.08,12.4 27.48,14.8 27.48,24.4 26.48,25.4 24.68,25.4 21.38,28.7 21.38,30.3 21.18,30.5 21.18,34.3 22.78,35.9 v24.18,35.9
  Bottom 0.2: U$11.8 21.98,12.4 v22.08,12.3
TFT_DC  (via drill 0.35)
  Top 0.2: v22.78,26.2 22.78,27.7 U$33.D6
  Route15 0.2: v23.78,17.89 24.28,18.39 24.28,24.8 22.88,26.2 v22.78,26.2
  Bottom 0.2: U$11.7 21.28,17.5 21.68,17.9 v23.78,17.9 v23.78,17.89
TFT_MOSI  (via drill 0.35)
  Top 0.2: v17.48,29.6 17.28,29.6 U$33.Z4
  Route15 0.2: v23.08,11.5 21.88,11.5 20.58,12.8 20.58,18.5 18.58,20.5 18.58,28.9 17.88,29.6 v17.48,29.6
  Bottom 0.2: U$11.10 23.38,11.8 v23.08,11.5
TFT_RST  (via drill 0.35)
  Top 0.2: v21.98,31.9 21.98,30.9 U$33.D4
  Route15 0.2: v26.78,12.7 27.18,12.7 27.98,13.5 27.98,24.6 26.78,25.8 24.98,25.8 22.28,28.5 22.28,31.6 v21.98,31.9
  Bottom 0.2: v26.78,12.7 26.48,12.4 24.58,12.4 24.08,12.9 U$11.11
TFT_SCK  (via drill 0.35)
  Top 0.2: U$33.Z6 v15.88,26.9
  Route2 0.2: v25.18,17.8 25.18,19.6 22.18,22.6 18.48,22.6 15.88,25.2 v15.88,26.9
  Bottom 0.2: U$11.9 22.68,17 22.88,17.2 24.68,17.2 25.18,17.7 v25.18,17.8
UART_RX  (via drill 0.35)
  Top 0.2: U$33.D5 23.38,29.6 23.48,29.6 v23.48,29.65 | v10.68,36 8.93,36 RX.TP
  Bottom 0.2: v23.48,29.65 23.22,29.65 22.68,30.2 22.68,34.3 19.88,37.1 11.78,37.1 v10.68,36
UART_TX  (via drill 0.35)
  Top 0.2: U$33.C5 20.68,28.4 v20.48,28.4 | v10.28,34.7 9.38,34.7 TX.TP
  Top 0.254: RN3.8 29.68,33.3 v28.88,32.5
  Route2 0.254: v28.88,32.5 28.38,32.5 27.38,33.5 24.98,33.5 22.48,31 22.48,30.4 v20.48,28.4
  Bottom 0.2: v10.28,34.7 10.58,34.4 17.58,34.4 21.28,30.7 21.28,29.2 v20.48,28.4
USB_D+  (via drill 0.35)
  Top 0.2: U$33.E4 24.08,30.15 v23.53,30.7 | v26.53,24.05 26.63,23.95 R32.2
  Bottom 0.2: v23.53,30.7 24.33,29.9 24.33,28.85 24.73,28.45 24.73,25.85 v26.53,24.05
USB_D-
  Top 0.2: U$33.E5 24.93,28.25 24.93,26.35 25.78,25.5 25.78,23.65 26.68,22.75 R31.2
VBAT
  Top 0.254: D2.C 32.63,17.01 Q1.2 32.62,16.4 C3.1 31.01,16.18 U9.3 29.93,17 29.48,17.45 28.48,17.45 28.03,17 U9.1
VUSB2  (via drill 0.35)
  Top 0.254: C5.1 35.08,13.2 34.51,12.63 U8.2 U8.1 | J2.B4 34.73,26.05 34.48,26.3 J2.A9 33.28,26.3 32.88,26.7 v32.88,26.9 32.88,27.95 R4.2 | J2.A4 34.38,23.3 34.63,23.55 J2.B9 36.03,23.55 36.28,23.3 36.28,19.9 34.93,18.55 34.93,18.4 | 34.93,18.4 D2.A | 34.93,18.4 34.53,18.8 v33.68,18.8 32.58,19.9 27.28,19.9 26.88,19.5 R52.1
  Top 0.406: C5.1 34.83,14.2 Q1.1 | D2.A 34.93,16.81 Q1.1 | Q1.1 36.07,16.71 R29.2
  Route15 0.254: v33.68,18.8 32.88,19.6 v32.88,26.9

### Text on the board
tPlace: v1 | RTS | 10/23 | CTS | RX | GND | TX | U3 | GND | B+ | pc_healthypi_move | GND | B- | 3V3 | protocentral.com
bPlace: pc_healthypi_move | 10/23 | v1 | protocentral.com